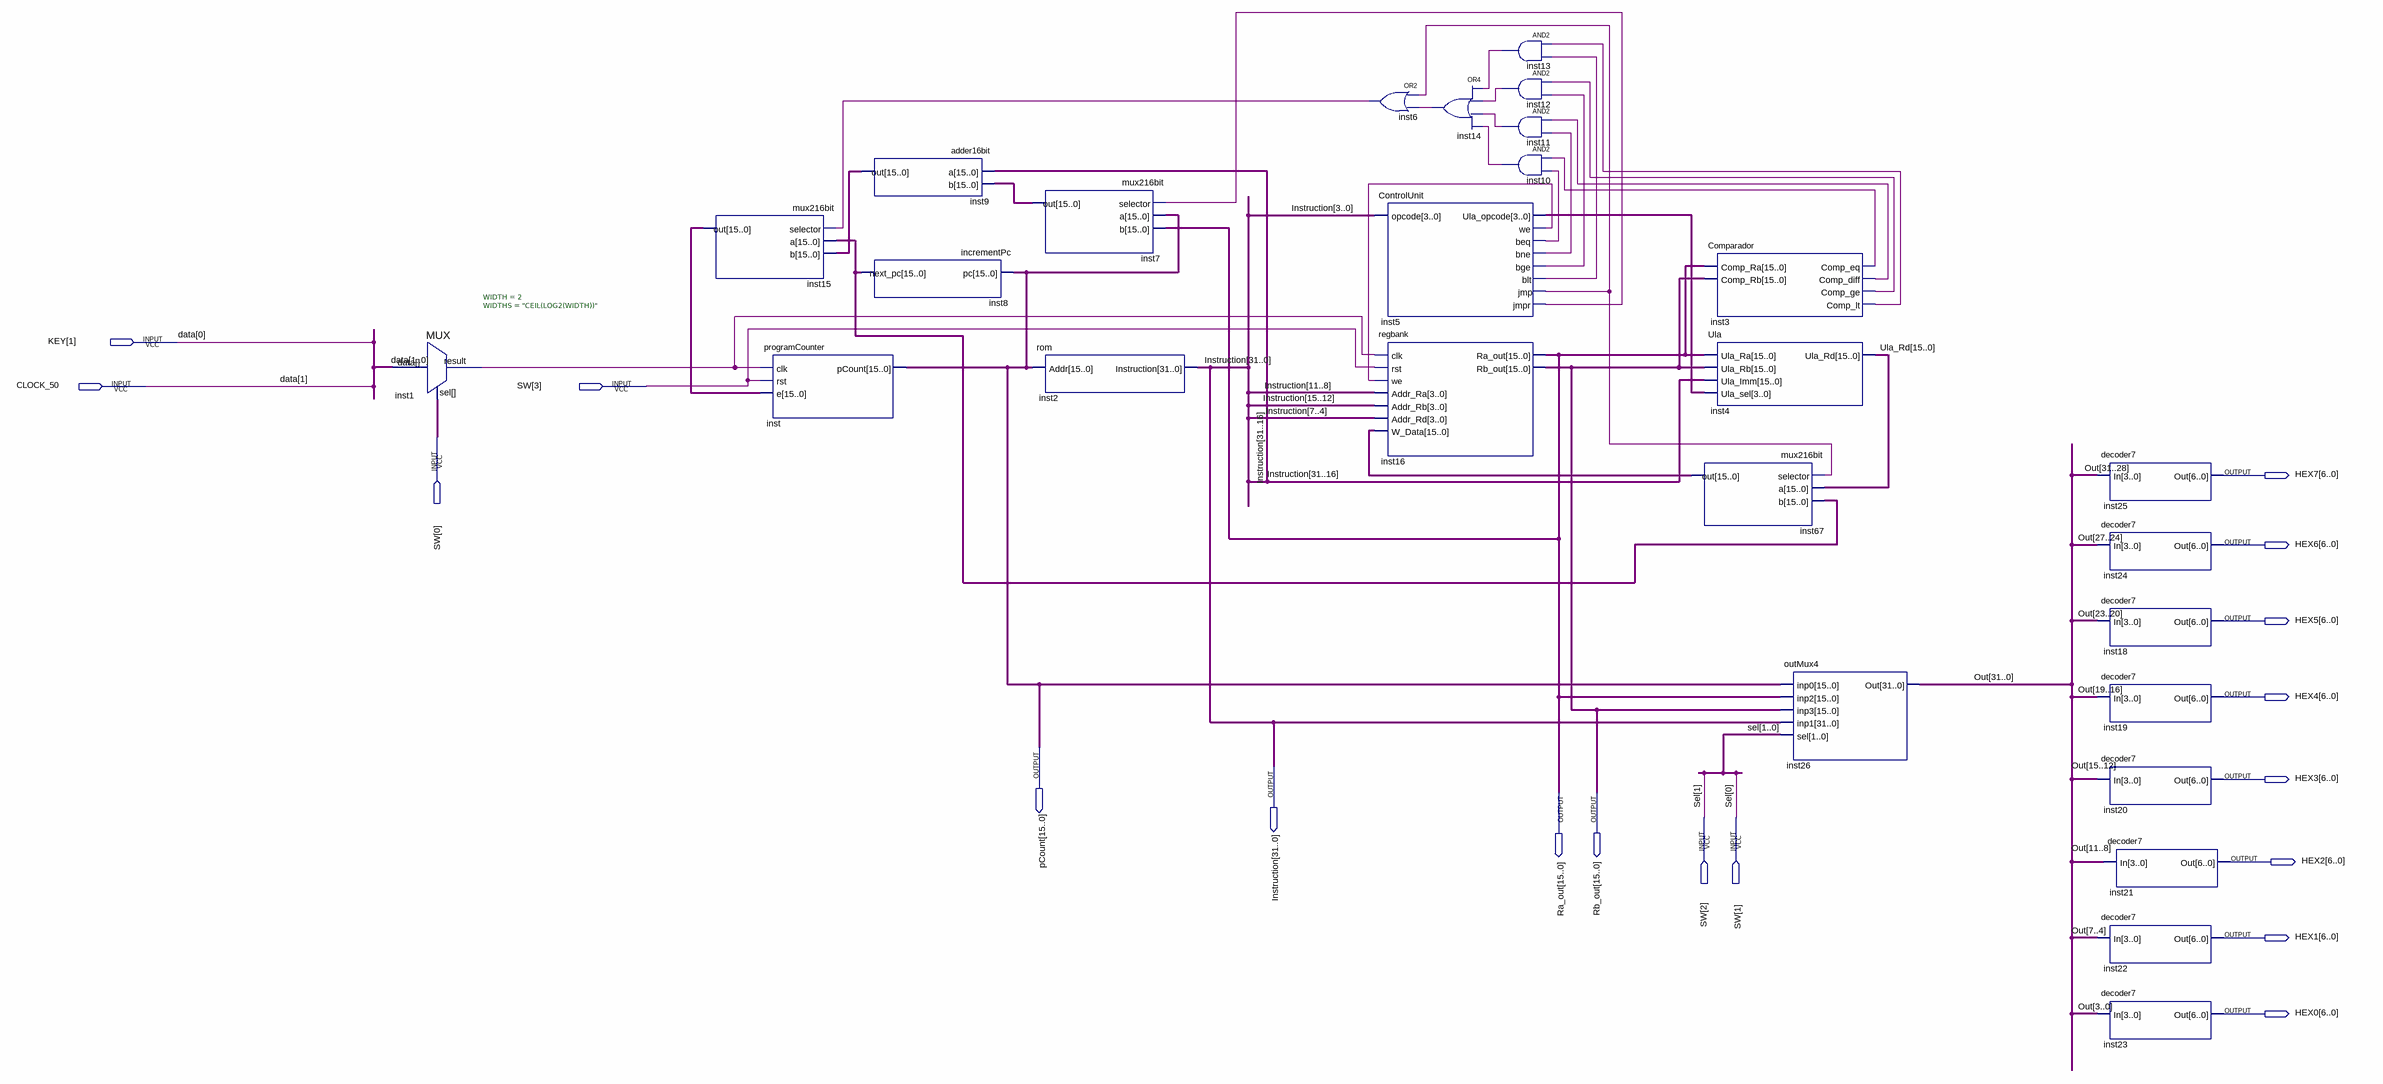
[diagram p0: schematic sheet]
// Quartus schematic Zepto.bdf as structural Verilog: 27 symbols, 18 pins
module Zepto (
  input  [1:1] KEY,
  input  CLOCK_50,
  input  [3:0] SW,
  output [6:0] HEX7,
  output [6:0] HEX6,
  output [6:0] HEX5,
  output [6:0] HEX4,
  output [15:0] pCount,
  output [31:0] Instruction,
  output [6:0] HEX3,
  output [15:0] Ra_out,
  output [15:0] Rb_out,
  output [6:0] HEX2,
  output [6:0] HEX1,
  output [6:0] HEX0
);

  wire inst1_result, inst3_comp_diff, inst3_comp_eq, inst3_comp_ge, inst3_comp_lt, inst5_beq, inst5_bge,
       inst5_blt, inst5_bne, inst5_jmp, inst5_jmpr, inst5_we, inst6_out, inst10_out, inst11_out, inst12_out,
       inst13_out, inst14_out;
  wire [3:0] inst5_ula_opcode;
  wire [15:0] inst7_out, inst8_next_pc, inst9_out, inst15_out, inst67_out, Ula_Rd;
  wire [31:0] Out;

  MUX #(.WIDTH(2), .WIDTHS("CEIL(LOG2(WIDTH))")) inst1 (.data({CLOCK_50, KEY[1]}), .sel(SW[0]), .result(inst1_result));
  mux216bit inst15 (.selector(inst6_out), .a(inst8_next_pc), .b(inst9_out), .out(inst15_out));
  programCounter inst (.clk(inst1_result), .rst(SW[3]), .e(inst15_out), .pCount(pCount));
  adder16bit inst9 (.a(Instruction[31:16]), .b(inst7_out), .out(inst9_out));
  incrementPc inst8 (.pc(pCount), .next_pc(inst8_next_pc));
  mux216bit inst7 (.selector(inst5_jmpr), .a(pCount), .b(Ra_out), .out(inst7_out));
  rom inst2 (.Addr(pCount), .Instruction(Instruction));
  or inst6 (inst6_out, inst5_jmp, inst14_out);
  ControlUnit inst5 (
    .opcode(Instruction[3:0]), .Ula_opcode(inst5_ula_opcode), .we(inst5_we), .beq(inst5_beq),
    .bne(inst5_bne), .bge(inst5_bge), .blt(inst5_blt), .jmp(inst5_jmp), .jmpr(inst5_jmpr));
  regbank inst16 (
    .clk(inst1_result), .rst(SW[3]), .we(inst5_we), .Addr_Ra(Instruction[11:8]),
    .Addr_Rb(Instruction[15:12]), .Addr_Rd(Instruction[7:4]), .W_Data(inst67_out), .Ra_out(Ra_out),
    .Rb_out(Rb_out));
  or inst14 (inst14_out, inst13_out, inst12_out, inst11_out, inst10_out);
  and inst13 (inst13_out, inst3_comp_lt, inst5_blt);
  and inst12 (inst12_out, inst3_comp_ge, inst5_bge);
  and inst11 (inst11_out, inst3_comp_diff, inst5_bne);
  and inst10 (inst10_out, inst3_comp_eq, inst5_beq);
  Comparador inst3 (
    .Comp_Ra(Ra_out), .Comp_Rb(Rb_out), .Comp_eq(inst3_comp_eq), .Comp_diff(inst3_comp_diff),
    .Comp_ge(inst3_comp_ge), .Comp_lt(inst3_comp_lt));
  Ula inst4 (
    .Ula_Ra(Ra_out), .Ula_Rb(Rb_out), .Ula_Imm(Instruction[31:16]), .Ula_sel(inst5_ula_opcode),
    .Ula_Rd(Ula_Rd));
  mux216bit inst67 (.selector(inst5_jmp), .a(Ula_Rd), .b(inst8_next_pc), .out(inst67_out));
  outMux4 inst26 (.inp0(pCount), .inp2(Ra_out), .inp3(Rb_out), .inp1(Instruction), .sel(SW[2:1]), .Out(Out));
  decoder7 inst25 (.In(Out[31:28]), .Out(HEX7));
  decoder7 inst24 (.In(Out[27:24]), .Out(HEX6));
  decoder7 inst18 (.In(Out[23:20]), .Out(HEX5));
  decoder7 inst19 (.In(Out[19:16]), .Out(HEX4));
  decoder7 inst20 (.In(Out[15:12]), .Out(HEX3));
  decoder7 inst21 (.In(Out[11:8]), .Out(HEX2));
  decoder7 inst22 (.In(Out[7:4]), .Out(HEX1));
  decoder7 inst23 (.In(Out[3:0]), .Out(HEX0));

  // Other names for the same wires on the sheet: data[1:0] = {CLOCK_50, KEY[1]}; sel[1:0] = SW[2:1]
endmodule
